# Altium schematic sheet Step-down converter.SchDoc
size A4; SheetNumber: 2; SheetTotal: 4
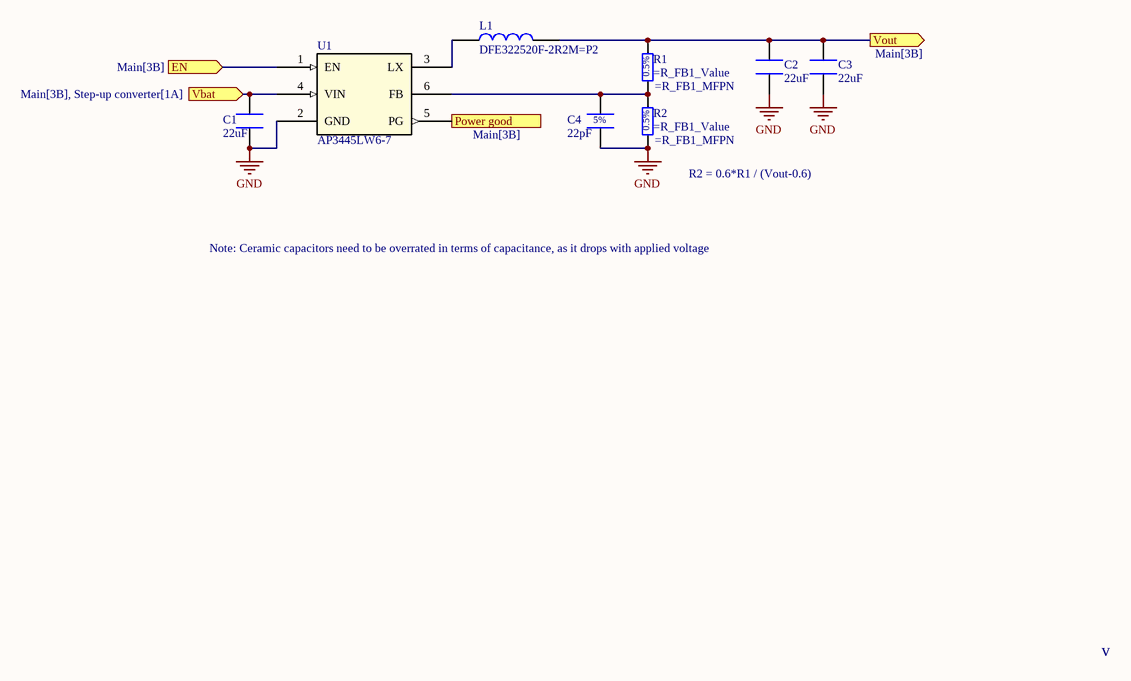
[diagram p0: Step-down converter.SchDoc]

## Parts
C1  22uF  [CAPACITOR_0805_2012M-70N]
C2  22uF  [CAPACITOR_0805_2012M-70N]
C3  22uF  [CAPACITOR_0805_2012M-70N]
C4  22pF  [CAPACITOR_0805_2012M-70N]
L1  DFE322520F-2R2M=P2  [INDC3225X200N]
R1  (no value)  [Resistor_0805_2012M-50N]
R2  (no value)  [Resistor_0805_2012M-50N]
U1  AP3445LW6-7  [SOT23-5N-1.45mm]

## Ports
EN (in, see Main[3B]), Power good (out, see Main[3B]), Vbat (in, see Main[3B], Step-up converter[1A]), Vout (out, see Main[3B])

## Nets
GND: C1.1 C2.1 C3.1 C4.1 R2.1 U1.2(GND)
EN: U1.1(EN) ; port EN
Power good: U1.5(PG) ; port Power good
Vbat: C1.2 U1.4(VIN) ; port Vbat
Vout: C2.2 C3.2 L1.1 R1.2 ; port Vout
NetC4_2: C4.2 R1.1 R2.2 U1.6(FB)
NetL1_2: L1.2 U1.3(LX)

## Notes on the sheet
- (near R2) R2 = 0.6*R1 / (Vout-0.6)
- Note: Ceramic capacitors need to be overrated in terms of capacitance, as it drops with applied voltage
- v

## Library data of the parts
C1-C3 = C0805C226M9PACTU: Passive - Capacitor, X5R, 22uF Max, 6.3V, 0805 (2012 Metric), ±20%, -55°C ~ 85°C. 8.8uF @ 5V; APSS Standard Part: APSS Standard; Capacitance at Rated Voltage: 30%; Tolerance: ±20%; Temperature Coefficient: X5R; Rated Voltage: 6.3V; Temp Range: -55°C ~ 85°C; Package: 0805; Supplier 1: Digikey; Supplier 1 Part No.: 399-C0805C226M9PAC7800CT-ND; MF Part No.: C0805C226M9PACTU; Value: 22uF
C4 = Generic Capacitor: MF Part No.: C0805C220J5GACTU; Tolerance: 5%; Temperature Coefficient: C0G; Rated Voltage: 50V; Capacitance at Rated Voltage: 100%; Temp Range: -55 ~ 125C; Supplier 1: Digikey; Supplier 1 Part No.: 399-C0805C220J5GAC7800CT-ND; Package: 0805; Value: 22pF
L1 = DFE322520F-2R2M=P2: 2.2 H Shielded Wirewound Inductor 3.3 A 40mOhm Max 1210 (3225 Metric); MF Part No.: DFE322520F-2R2M=P2; Supplier 1 Part No.: 490-DFE322520F-2R2M=P2CT-ND; Supplier 1: Digikey
R1 R2 = RG2012P-xxx-D-T5 Series: Passive - Resistor Series, 0805, 0.5%, 10 - 1M, E24, 0.063W, 1/8W, ±25ppm/°C, -55°C ~ 155°C, 0805 (2012 Metric); APSS Standard Part: APSS Standard; Value Range: 10 ~ 1M; Rated Voltage: 150V; Tolerance: 0.5%; Power: 1/8W; E Series: E24; Temp Range: -55°C ~ 155°C; Supplier 1: Digikey; Package: 0805; Temperature Coefficient: ±25ppm/°C; MF Part No.: =R_FB1_MFPN; Value: =R_FB1_Value
U1 = AP3445LW6-7: IC - Regulator, Buck, 2A, 2.7V to 5.5V In, 0.6V to Vin Out, SOT23-6; APSS Standard Part: APSS Standard; Temp Range: -40°C ~ 85°C (TA); MF Part No.: AP3445LW6-7; Package: SOT-23-5; Supplier 1: Digikey; Supplier 1 Part No.: AP3445LW6-7DICT-ND; Rated Voltage: 5.5V